# Altium schematic sheet Sailbot Sheet Map.SchDoc
size D; SheetNumber: 1; SheetTotal: 12
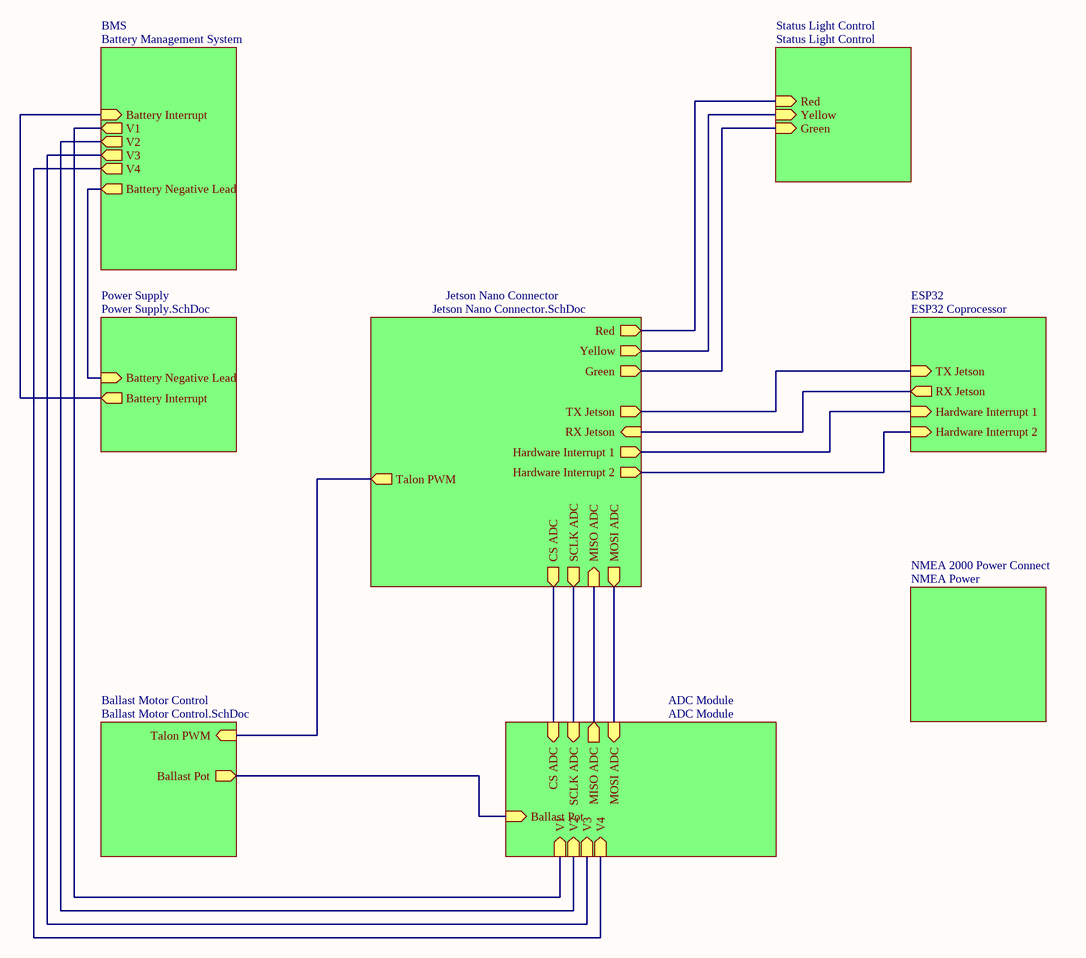
[diagram p0: Sailbot Sheet Map.SchDoc]

## Sub-sheets
ADC Module = ADC Module: Ballast Pot (in), MISO ADC (out), MOSI ADC (in), V1 (in), V2 (in), V3 (in), V4 (in), SCLK ADC (in), CS ADC (in)
Ballast Motor Control = Ballast Motor Control.SchDoc: Talon PWM (in), Ballast Pot (out)
BMS = Battery Management System: Battery Interrupt (in), V1 (out), V2 (out), V3 (out), V4 (out), Battery Negative Lead (out)
ESP32 = ESP32 Coprocessor: TX Jetson (in), RX Jetson (out), Hardware Interrupt 1 (in), Hardware Interrupt 2 (in)
Jetson Nano Connector = Jetson Nano Connector.SchDoc: Red (out), Yellow (out), Green (out), Talon PWM (out), MISO ADC (in), MOSI ADC (out), SCLK ADC (out), CS ADC (out), TX Jetson (out), RX Jetson (in), Hardware Interrupt 1 (out), Hardware Interrupt 2 (out)
NMEA 2000 Power Connect = NMEA Power: no entries
Power Supply = Power Supply.SchDoc: Battery Interrupt (out), Battery Negative Lead (in)
Status Light Control = Status Light Control: Yellow (in), Green (in), Red (in)

## Nets
(unnamed): sheet Power Supply/Battery Interrupt, sheet BMS/Battery Interrupt
(unnamed): sheet Power Supply/Battery Negative Lead, sheet BMS/Battery Negative Lead
(unnamed): sheet Jetson Nano Connector/Red, sheet Status Light Control/Red
(unnamed): sheet Jetson Nano Connector/Yellow, sheet Status Light Control/Yellow
(unnamed): sheet Jetson Nano Connector/Green, sheet Status Light Control/Green
(unnamed): sheet Jetson Nano Connector/Talon PWM, sheet Ballast Motor Control/Talon PWM
(unnamed): sheet Jetson Nano Connector/MISO ADC, sheet ADC Module/MISO ADC
(unnamed): sheet Jetson Nano Connector/MOSI ADC, sheet ADC Module/MOSI ADC
(unnamed): sheet Jetson Nano Connector/SCLK ADC, sheet ADC Module/SCLK ADC
(unnamed): sheet Jetson Nano Connector/CS ADC, sheet ADC Module/CS ADC
(unnamed): sheet Jetson Nano Connector/TX Jetson, sheet ESP32/TX Jetson
(unnamed): sheet Jetson Nano Connector/RX Jetson, sheet ESP32/RX Jetson
(unnamed): sheet Jetson Nano Connector/Hardware Interrupt 1, sheet ESP32/Hardware Interrupt 1
(unnamed): sheet Jetson Nano Connector/Hardware Interrupt 2, sheet ESP32/Hardware Interrupt 2
(unnamed): sheet Ballast Motor Control/Ballast Pot, sheet ADC Module/Ballast Pot
(unnamed): sheet ADC Module/V1, sheet BMS/V1
(unnamed): sheet ADC Module/V2, sheet BMS/V2
(unnamed): sheet ADC Module/V3, sheet BMS/V3
(unnamed): sheet ADC Module/V4, sheet BMS/V4